# Altium schematic sheet ingress.SchDoc: Power Ingress
size Letter; CheckedBy: J. Brinton; CompanyName: Signal Laboratories, Inc.; DrawnBy: J. Brinton; Engineer: J. Brinton; Address1: 3479 Edison Way; Address2: Menlo Park CA 94025; Address3: +1 (877) 778-8435; Address4: siglabs.com; Revision: 3; SheetNumber: 5; SheetTotal: 7
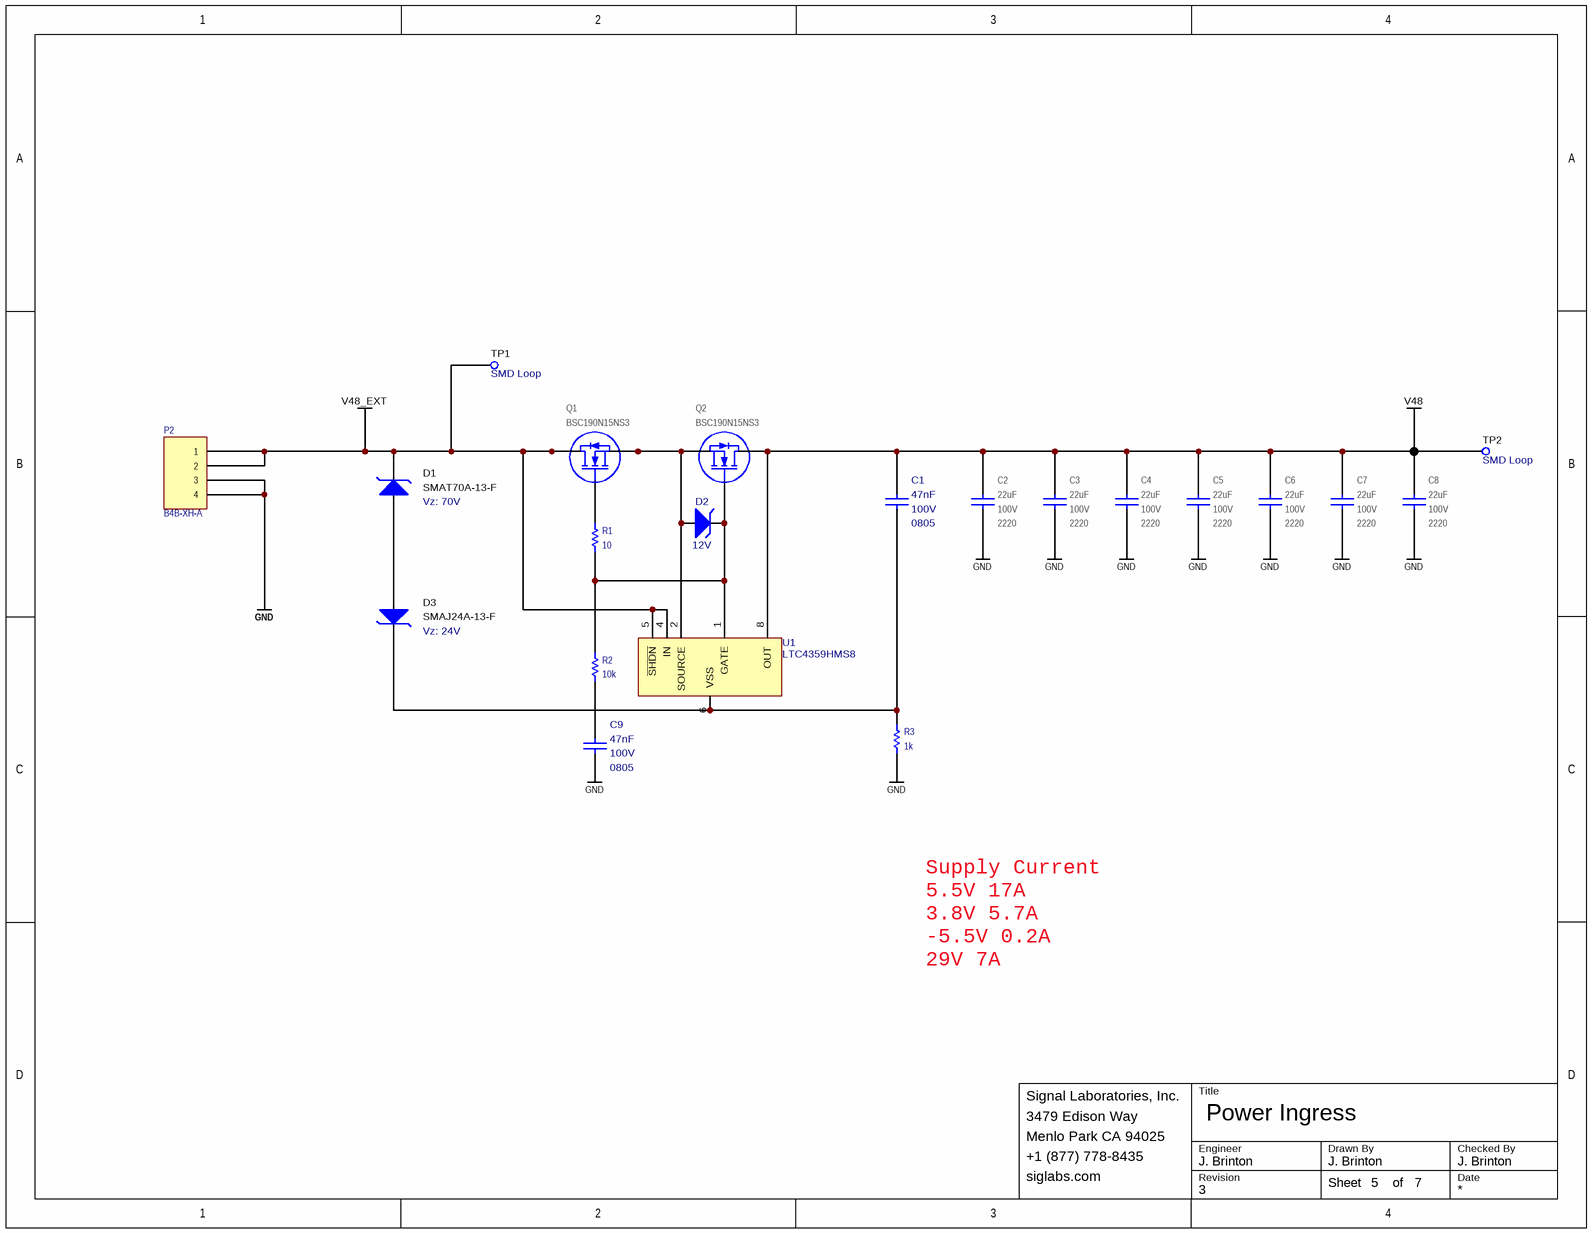
[diagram p0: ingress.SchDoc]

## Parts
C1  value 47nF  Package: 0805  Voltage: 100V  [CAPC200X125X145L45N]  (hidden comment: VJ0805Y473KXB)
C2  value 22uF  Voltage: 100V  Package: 2220  [CAPC600X500X500L160N]  (hidden comment: CKG57NX7S2A226M500JJ)
C3  value 22uF  Voltage: 100V  Package: 2220  [CAPC600X500X500L160N]  (hidden comment: CKG57NX7S2A226M500JJ)
C4  value 22uF  Voltage: 100V  Package: 2220  [CAPC600X500X500L160N]  (hidden comment: CKG57NX7S2A226M500JJ)
C5  value 22uF  Voltage: 100V  Package: 2220  [CAPC600X500X500L160N]  (hidden comment: CKG57NX7S2A226M500JJ)
C6  value 22uF  Voltage: 100V  Package: 2220  [CAPC600X500X500L160N]  (hidden comment: CKG57NX7S2A226M500JJ)
C7  value 22uF  Voltage: 100V  Package: 2220  [CAPC600X500X500L160N]  (hidden comment: CKG57NX7S2A226M500JJ)
C8  value 22uF  Voltage: 100V  Package: 2220  [CAPC600X500X500L160N]  (hidden comment: CKG57NX7S2A226M500JJ)
C9  value 47nF  Package: 0805  Voltage: 100V  [CAPC200X125X145L45N]  (hidden comment: VJ0805Y473KXB)
D1  SMAT70A-13-F  Vz: 70V  [SMA]
D2  Vz: 12V  [SOD123]  (hidden comment: DDZ12BQ-7)
D3  SMAJ24A-13-F  Vz: 24V  [SMA]
P2  B4B-XH-A  [B4B-XH-A]
Q1  BSC190N15NS3  [TDSON-8]
Q2  BSC190N15NS3  [TDSON-8]
R1  value 10  [RESC1005X40N]  (hidden comment: MCS04020C1009FE000)
R2  value 10k  [RESC2012X70N]  (hidden comment: RC0805FR-0710KL)
R3  value 1k  [RESC2012X70N]  (hidden comment: RC0805FR-071KL)
TP1  Notes: SMD Loop  [5015]  (hidden comment: 5015)
TP2  Notes: SMD Loop  [5015]  (hidden comment: 5015)
U1  LTC4359HMS8  [MSOP8]

## Nets
GND: C2.1 C3.1 C4.1 C5.1 C6.1 C7.1 C8.1 C9.2 P2.3 P2.4 R3.1
V48: C1.1 C2.2 C3.2 C4.2 C5.2 C6.2 C7.2 C8.2 Q2.5(D) Q2.6(D) Q2.7(D) Q2.8(D) Q2.9(D) TP2.1 U1.8(OUT)
V48_EXT: D1.2(K) P2.1 P2.2 Q1.5(D) Q1.6(D) Q1.7(D) Q1.8(D) Q1.9(D) TP1.1 U1.4(IN) U1.5(~{SHDN})
NetC1_2: C1.2 D3.2(K) R3.2 U1.6(VSS)
NetC9_1: C9.1 R2.1
NetD1_1: D1.1(A) D3.1(A)
NetD2_1: D2.1(A) Q1.1(S) Q1.2(S) Q1.3(S) Q2.1(S) Q2.2(S) Q2.3(S) U1.2(SOURCE)
NetD2_2: D2.2(K) Q2.4(G) R1.1 R2.2 U1.1(GATE)
NetQ1_4: Q1.4(G) R1.2

Not connected (* = marked no-connect by the designer): U1 3(NC) 7(NC)

## Notes on the sheet
- Supply	Current
  5.5V	17A
  3.8V	5.7A
  -5.5V	0.2A
  29V	7A
- Title
- Engineer
- Revision
- Drawn By
- Checked By
- Date
- Sheet
- of

## Library data of the parts
C1 C9 = VJ0805Y473KXB: Ceramic Capacitor 47nF ±10% 100V X7R 0805; Manufacturer: Vishay; Tr: -55:150; Manufacturer P/N: VJ0805Y473KXB; Tolerance: ±10%
C2-C8 = CAP: Ceramic Capacitor 22uF ±20% 100V X7S Stacked; Manufacturer: TDK; Tr: -55:125; Manufacturer P/N: CKG57NX7S2A226M500JJ; Tolerance: ±20%
D1 = TVS: TVS Diode 70V/100V SMA; Manufacturer: Diodes Inc; Manufacturer P/N: SMAT70A-13-F
D2 = ZENER: Zener Diode 12V 370mW SOD123; Manufacturer: Diodes Inc; Manufacturer P/N: DDZ12BQ-7; Package: SOD-123
D3 = TVS: TVS Diode 24V/38.9V SMA; Manufacturer: Diodes Inc; Manufacturer P/N: SMAJ24A-13-F
P2 = S4B-XH-A: 2.5mm pitch 4-position connector; Manufacturer: JST; Manufacturer P/N: B4B-XH-A
Q1 Q2 = BSC190N15NS3: MOSFET N-Channel Enhancement Mode; Manufacturer: Infineon; Vds(max): 150V; Id(max): 50A; Rds(on): 19mOhm; Manufacturer P/N: BSC190N15NS3
R1 = RES: Thin Film Resistor 10 Ohm ±1% 0402; Manufacturer: Vishay; Tr: -55:155; Tcr: *; Tolerance: ±1%; Manufacturer P/N: MCS04020C1009FE000; Alternatives: *; Power: *; Package: 0402
R2 = RES: Thin Film Resistor 10k +/-1% SMD 0805; Manufacturer: Yageo; Tolerance: ±1%; Tr: -55:155; Voltage: 150V; Tcr: *; Manufacturer P/N: RC0805FR-0710KL; Alternatives: *; Power: *; Package: 0805
R3 = RES: Thin Film Resistor 1k +/-1% SMD 0805; Manufacturer: Yageo; Tolerance: ±1%; Tr: -55:155; Voltage: 150V; Tcr: *; Manufacturer P/N: RC0805FR-071KL; Alternatives: *; Power: *; Package: 0805
TP1 TP2 = TEST_POINT_SMD_50: Test Point SMD; Manufacturer: Keystone; Manufacturer P/N: 5015
U1 = LTC4359HMS8: Ideal Diode Controller; Manufacturer: Linear Technology; Manufacturer P/N: LTC4359HMS8